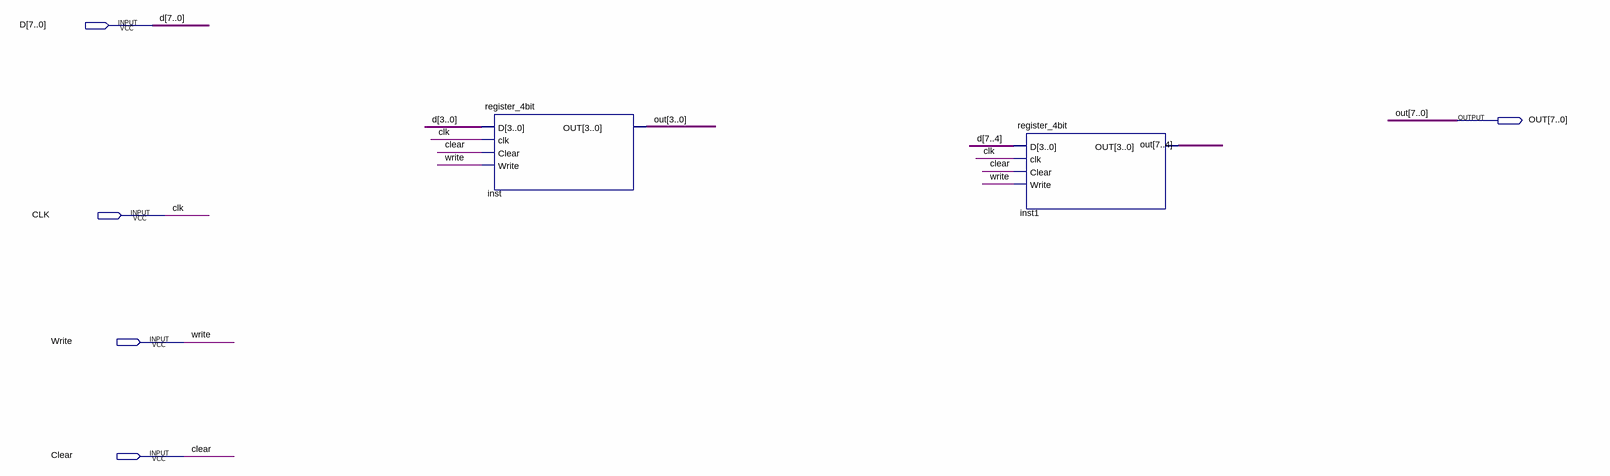
[diagram p0: schematic sheet]
// Quartus schematic register_8bit.bdf as structural Verilog: 2 symbols, 5 pins
module register_8bit (
  input  [7:0] D,
  input  CLK,
  input  Write,
  input  Clear,
  output [7:0] OUT
);

  register_4bit inst (.D(D[3:0]), .clk(CLK), .Clear(Clear), .Write(Write), .OUT(OUT[3:0]));
  register_4bit inst1 (.D(D[7:4]), .clk(CLK), .Clear(Clear), .Write(Write), .OUT(OUT[7:4]));
endmodule
